# EasyEDA schematic 03 - EasyEDA (Sensors).json

## Sheets
1 Main Schematic: TITLE: Car Assistant - Main; REV: 1.0; Date: 2023-02-03; Sheet: 1/2; Drawn By: ShonP40; Company: .
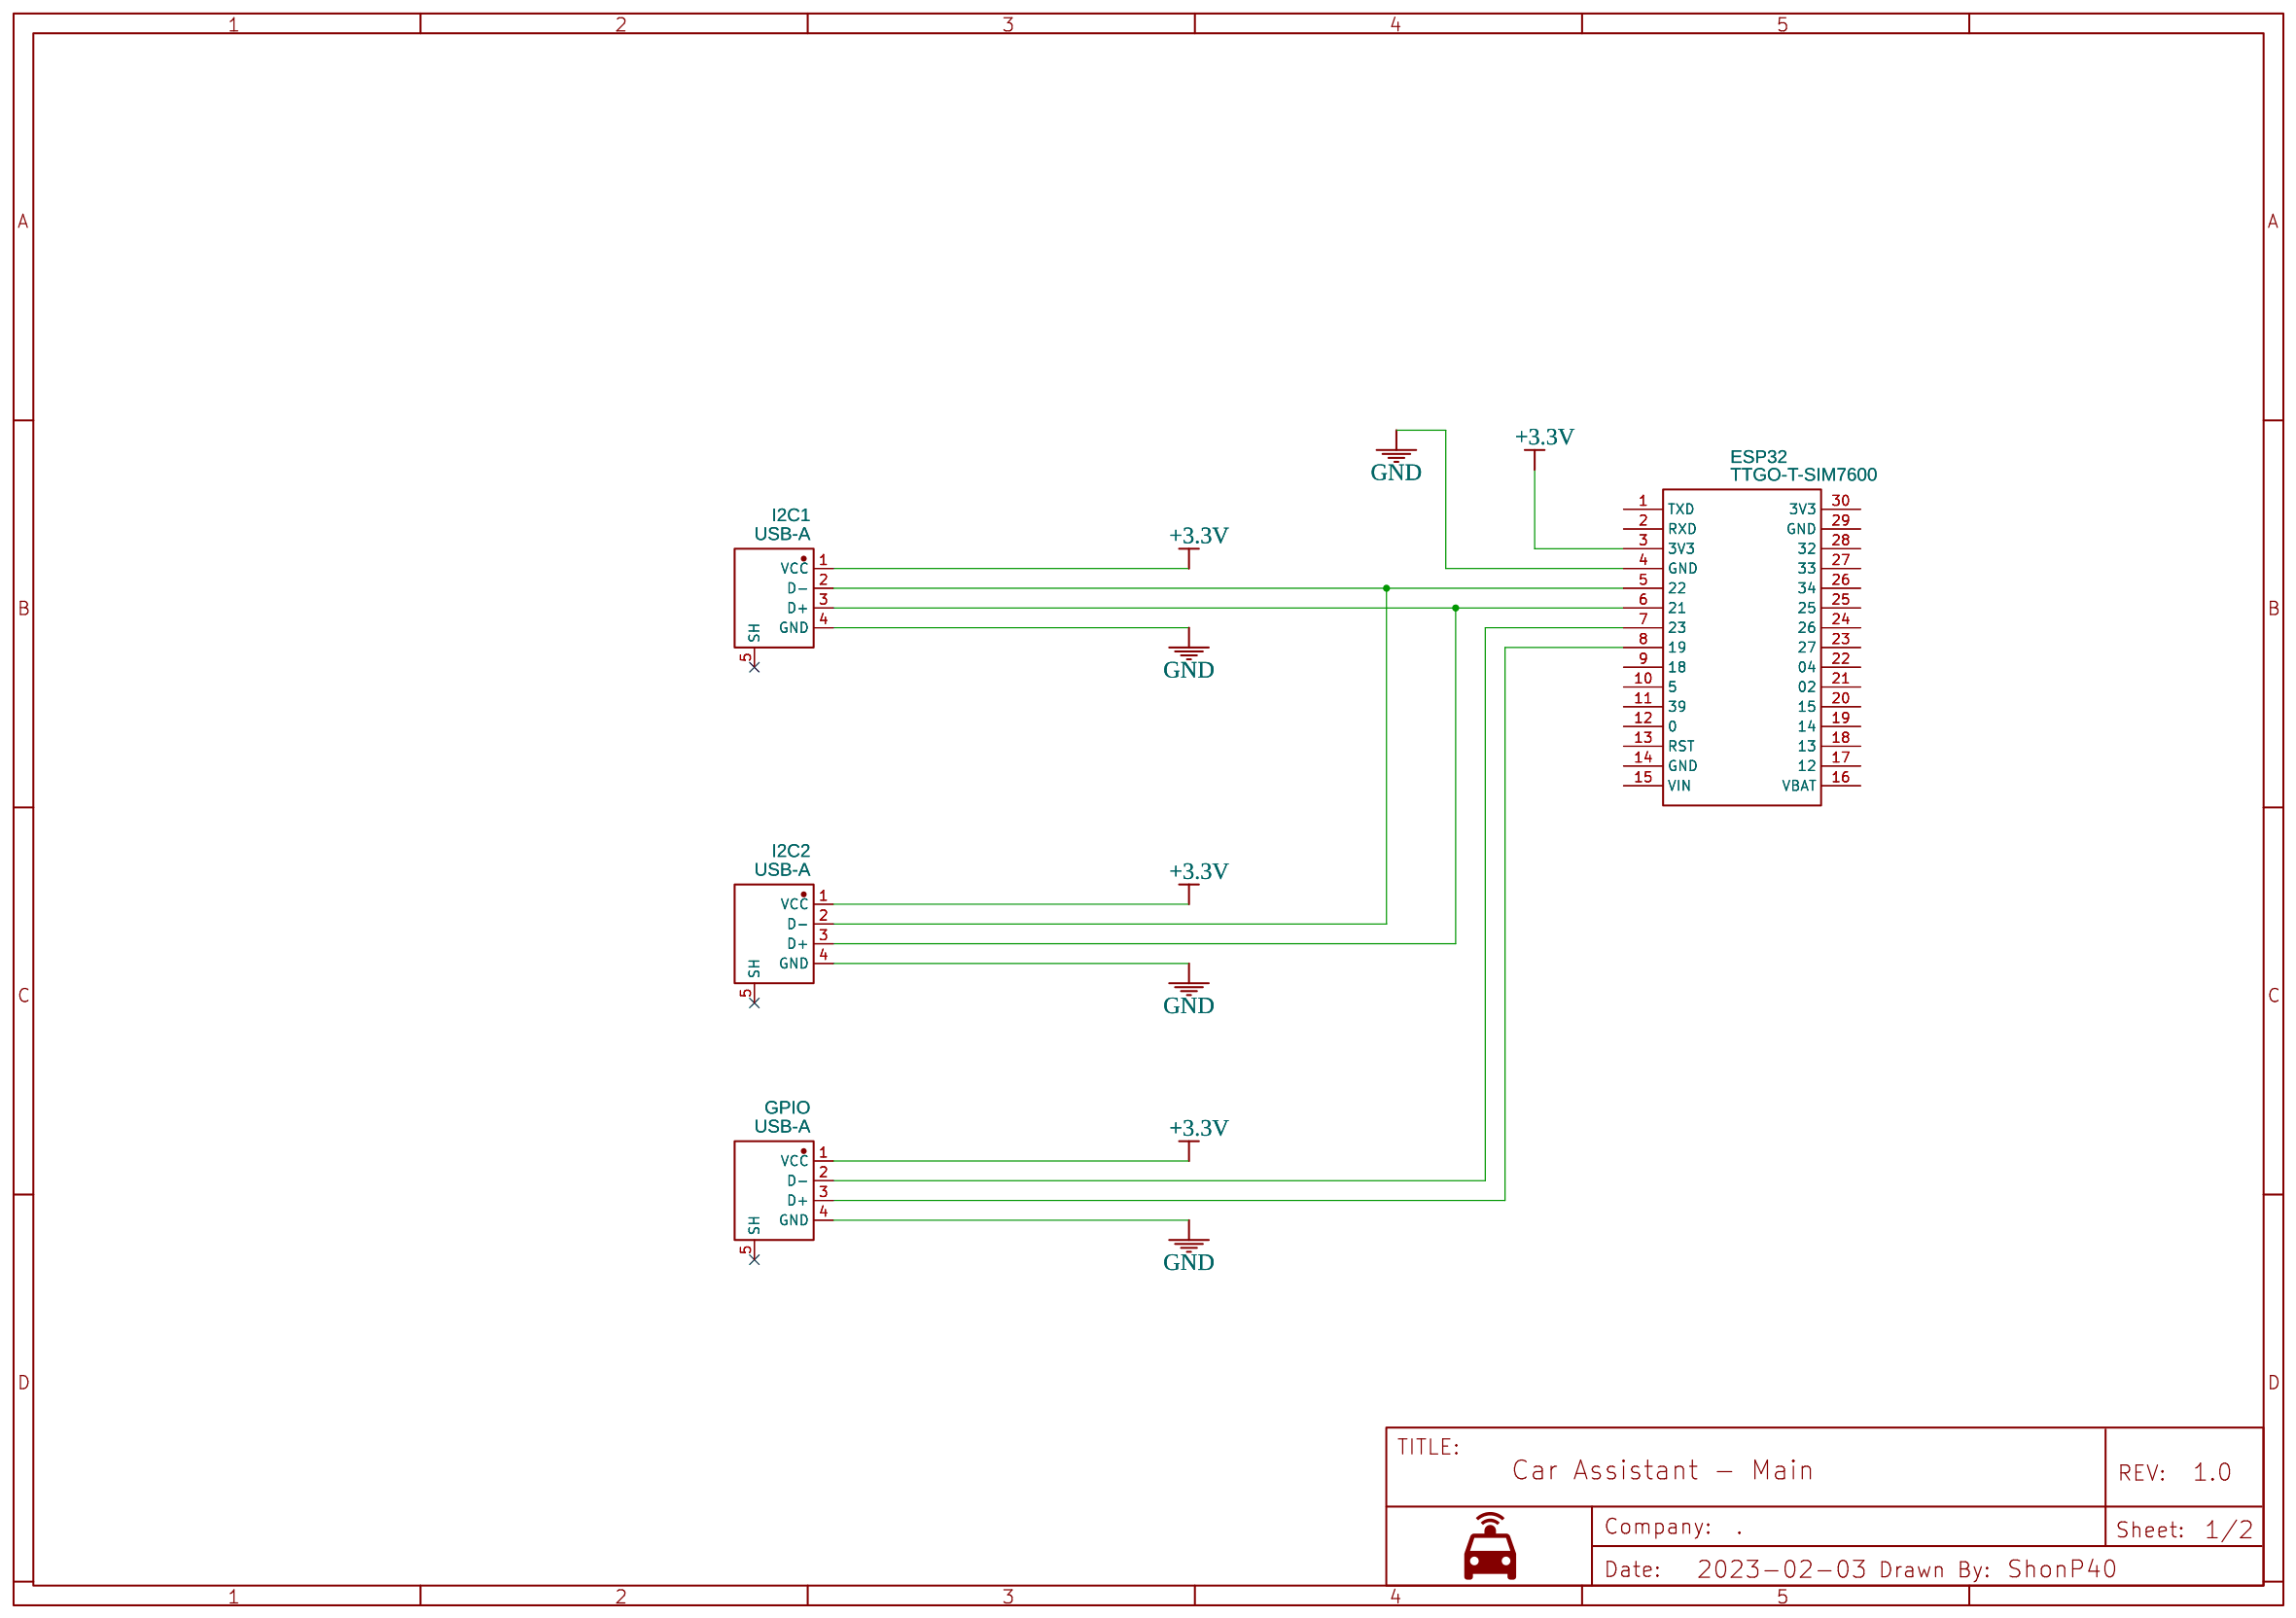
[diagram p0: Main Schematic]
2 Sensors Schematic: TITLE: Car Assistant - Sensors; Sheet: 2/2
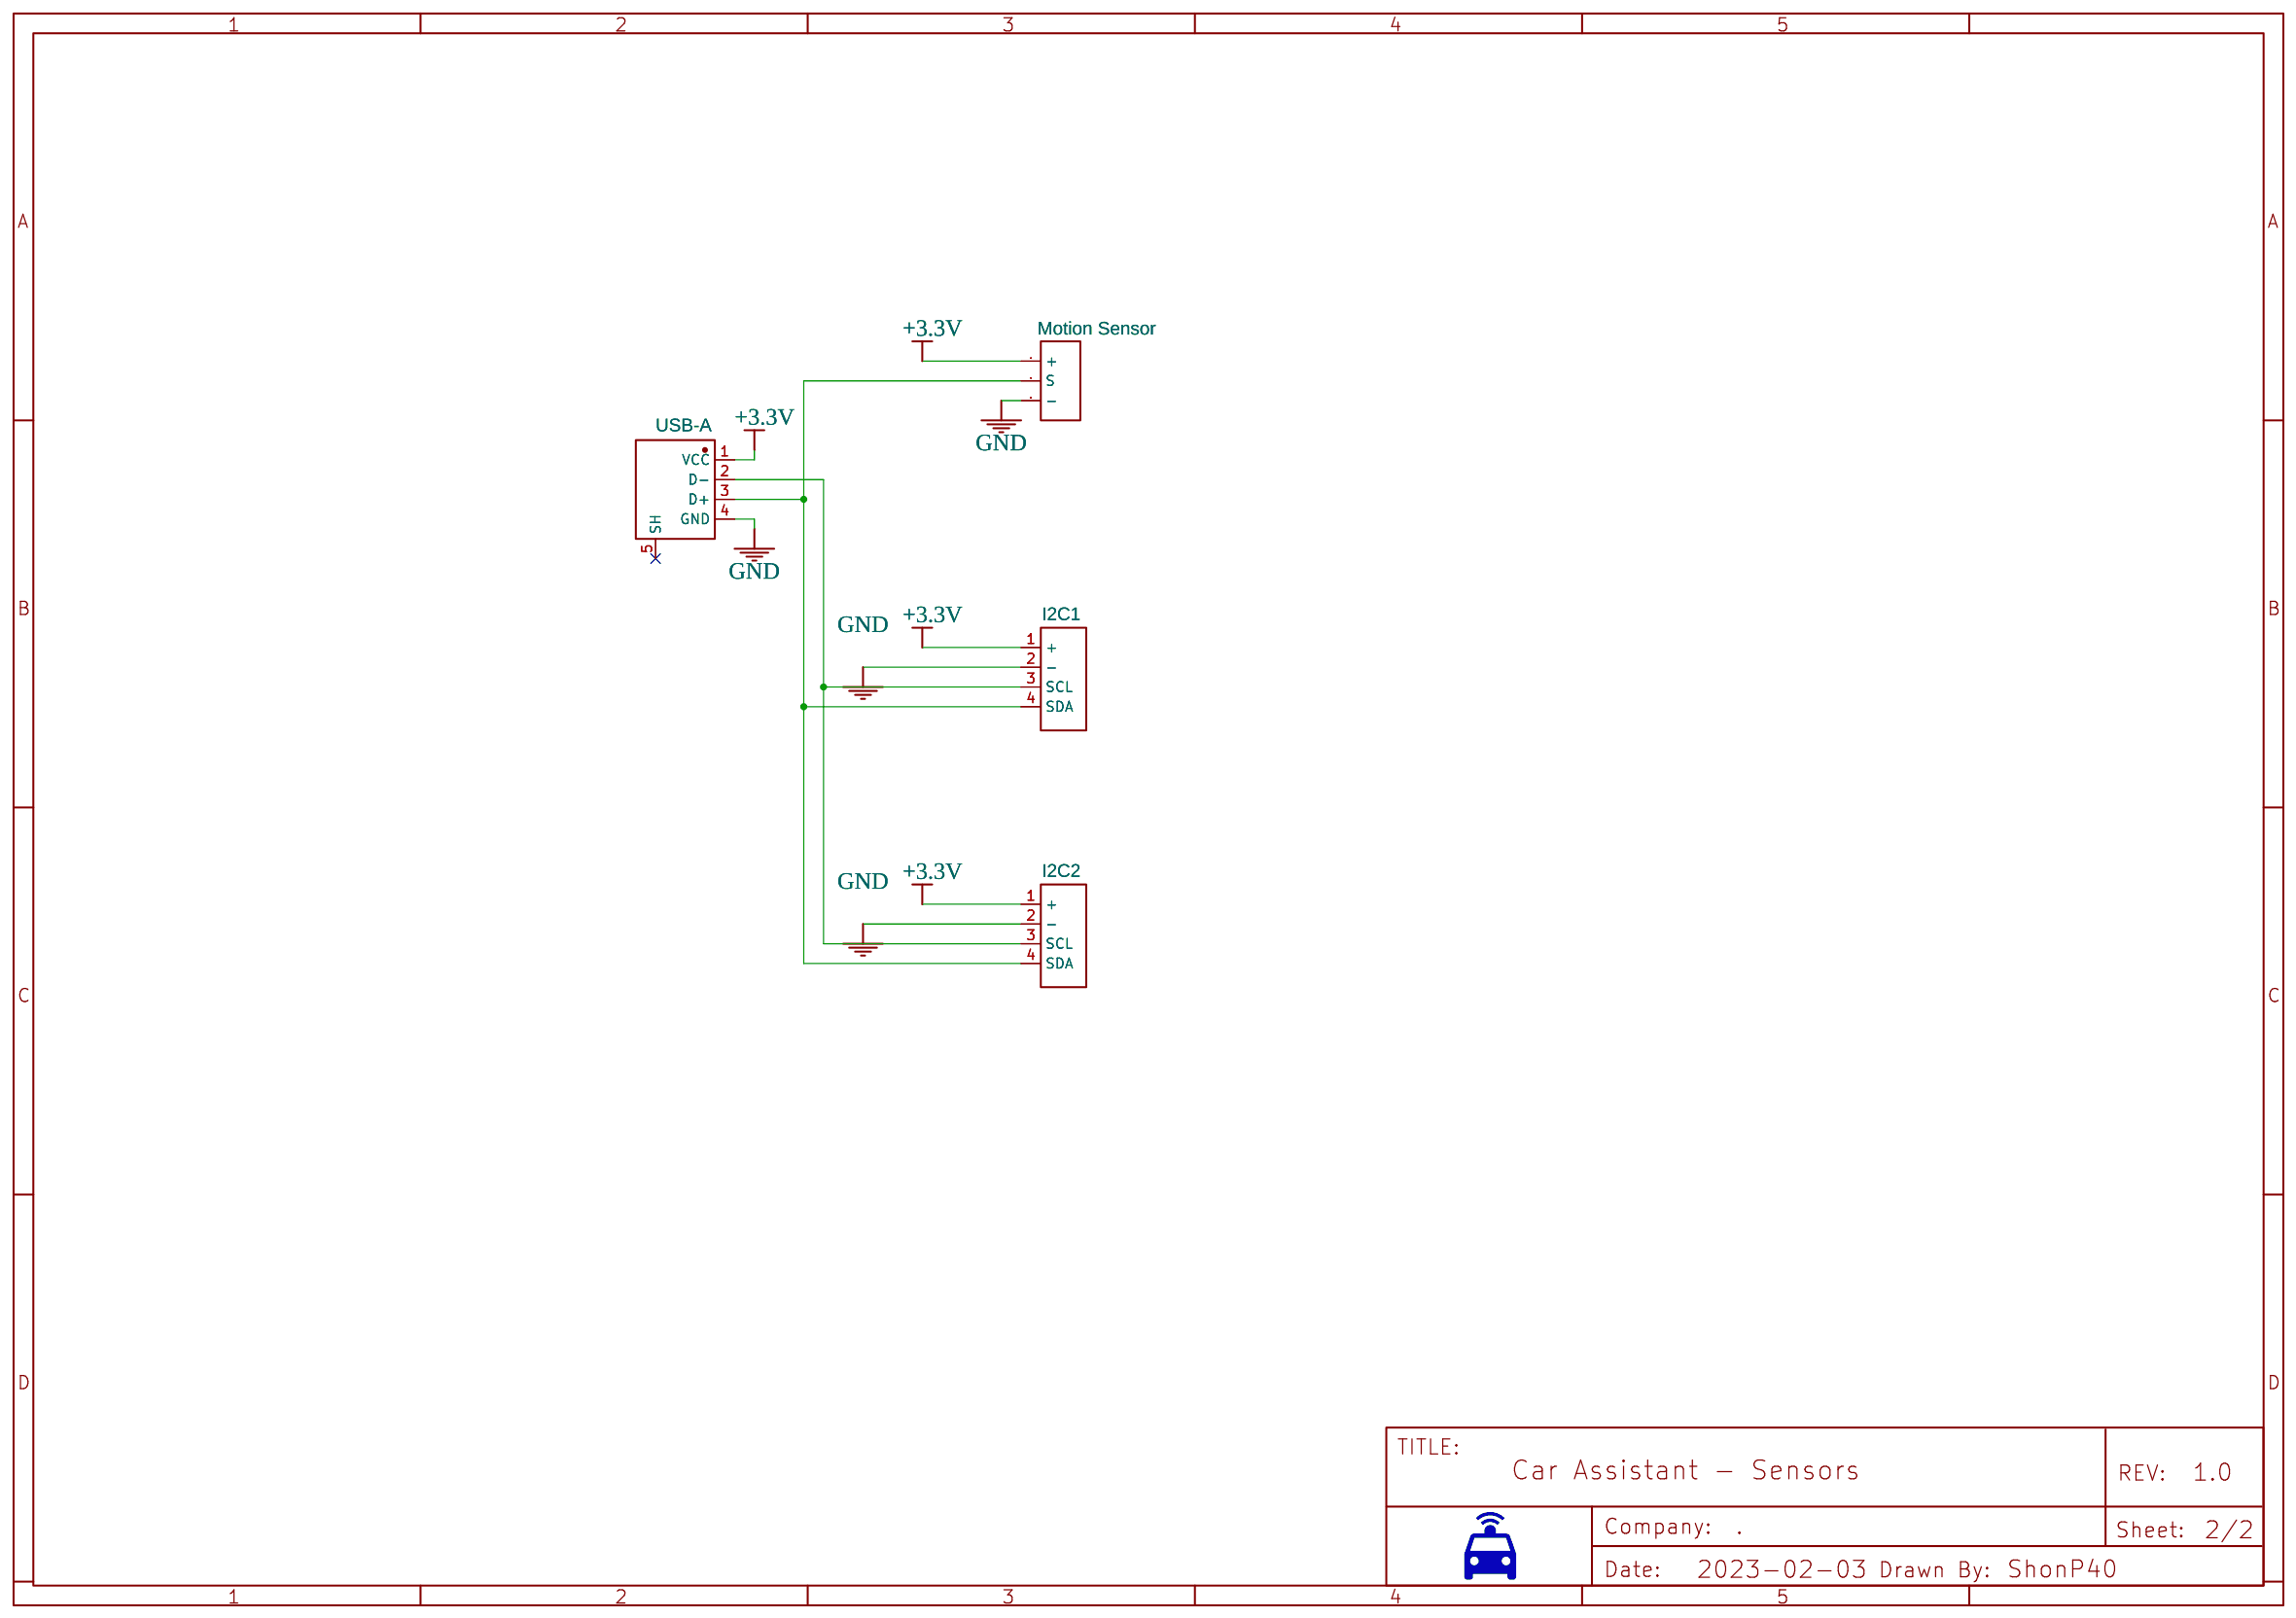
[diagram p1: Sensors Schematic]

## Parts
sheet Main Schematic
ESP32  TTGO-T-SIM7600  [TTGO-T-SIM7600]
GPIO  USB-A  [USB-A-TH_SIDE-SINK-USB-A]
I2C1  USB-A  [USB-A-TH_SIDE-SINK-USB-A]
I2C2  USB-A  [USB-A-TH_SIDE-SINK-USB-A]
sheet Sensors Schematic
I2C1#2  I2C1  [HEADER - HEADER-FEMALE-2.54_1X4]
I2C2#2  I2C2  [HEADER - HEADER-FEMALE-2.54_1X4]
MOTION  Motion Sensor  [HDR-TH_3P-P2.54-V-F]
OUTPUT  USB-A  [USB-A-TH_SIDE-SINK-USB-A]

## Library data of the parts
ESP32 = TTGO-T-SIM7600: Manufacturer Part: ESP32-TTGO-SIM7600; Supplier: Mouser; Contributor: TIN SHUNIJTANAKUN
GPIO I2C1 I2C2 OUTPUT = USB-A: Supplier: LCSC; Supplier Part: C9900005029; Manufacturer: null; Contributor: LCSC
I2C1#2 I2C2#2 = Header Female 1x4: Contributor: Sérgio Sousa; Supplier: Sparkfun
MOTION = Header-Female-2.54_1x3: Supplier Part: C146243; Supplier: LCSC; Manufacturer: BOOMELE(博穆精密); Manufacturer Part: 2.54-1*3P母; link: https://datasheet.lcsc.com/szlcsc/Boom-Precision-Elec-2-54mm-1-8P-Straight-Female-header_C27438.pdf; JLCPCB Part Class: Extended Part

## Nets
+3.3V: ESP32.3(3V3) GPIO.1(VCC) I2C1.1(VCC) I2C1#2.1(+) I2C2.1(VCC) I2C2#2.1(+) MOTION.1(+) OUTPUT.1(VCC)
GND: ESP32.4(GND) GPIO.4(GND) I2C1.4(GND) I2C1#2.2(-) I2C2.4(GND) I2C2#2.2(-) MOTION.3(-) OUTPUT.4(GND)
Net-(ESP32-5): ESP32.5(22) I2C1.2(D-) I2C2.2(D-)
Net-(ESP32-6): ESP32.6(21) I2C1.3(D+) I2C2.3(D+)
Net-(ESP32-7): ESP32.7(23) GPIO.2(D-)
Net-(ESP32-8): ESP32.8(19) GPIO.3(D+)
Net-(I2C1#2-3): I2C1#2.3(SCL) I2C2#2.3(SCL) OUTPUT.2(D-)
Net-(I2C1#2-4): I2C1#2.4(SDA) I2C2#2.4(SDA) MOTION.2(S) OUTPUT.3(D+)

Not connected (* = marked no-connect by the designer): ESP32 1(TXD) 2(RXD) 9(18) 10(5) 11(39) 12(0) 13(RST) 14(GND) 15(VIN) 16(VBAT) 17(12) 18(13) 19(14) 20(15) 21(02) 22(04) 23(27) 24(26) 25 26(34) 27(33) 28(32) 29(GND) 30(3V3); GPIO 5(SH)*; I2C1 5(SH)*; I2C2 5(SH)*; OUTPUT 5(SH)*
